# EAGLE design m140_attiny_V5c (EAGLE 6.5.0)
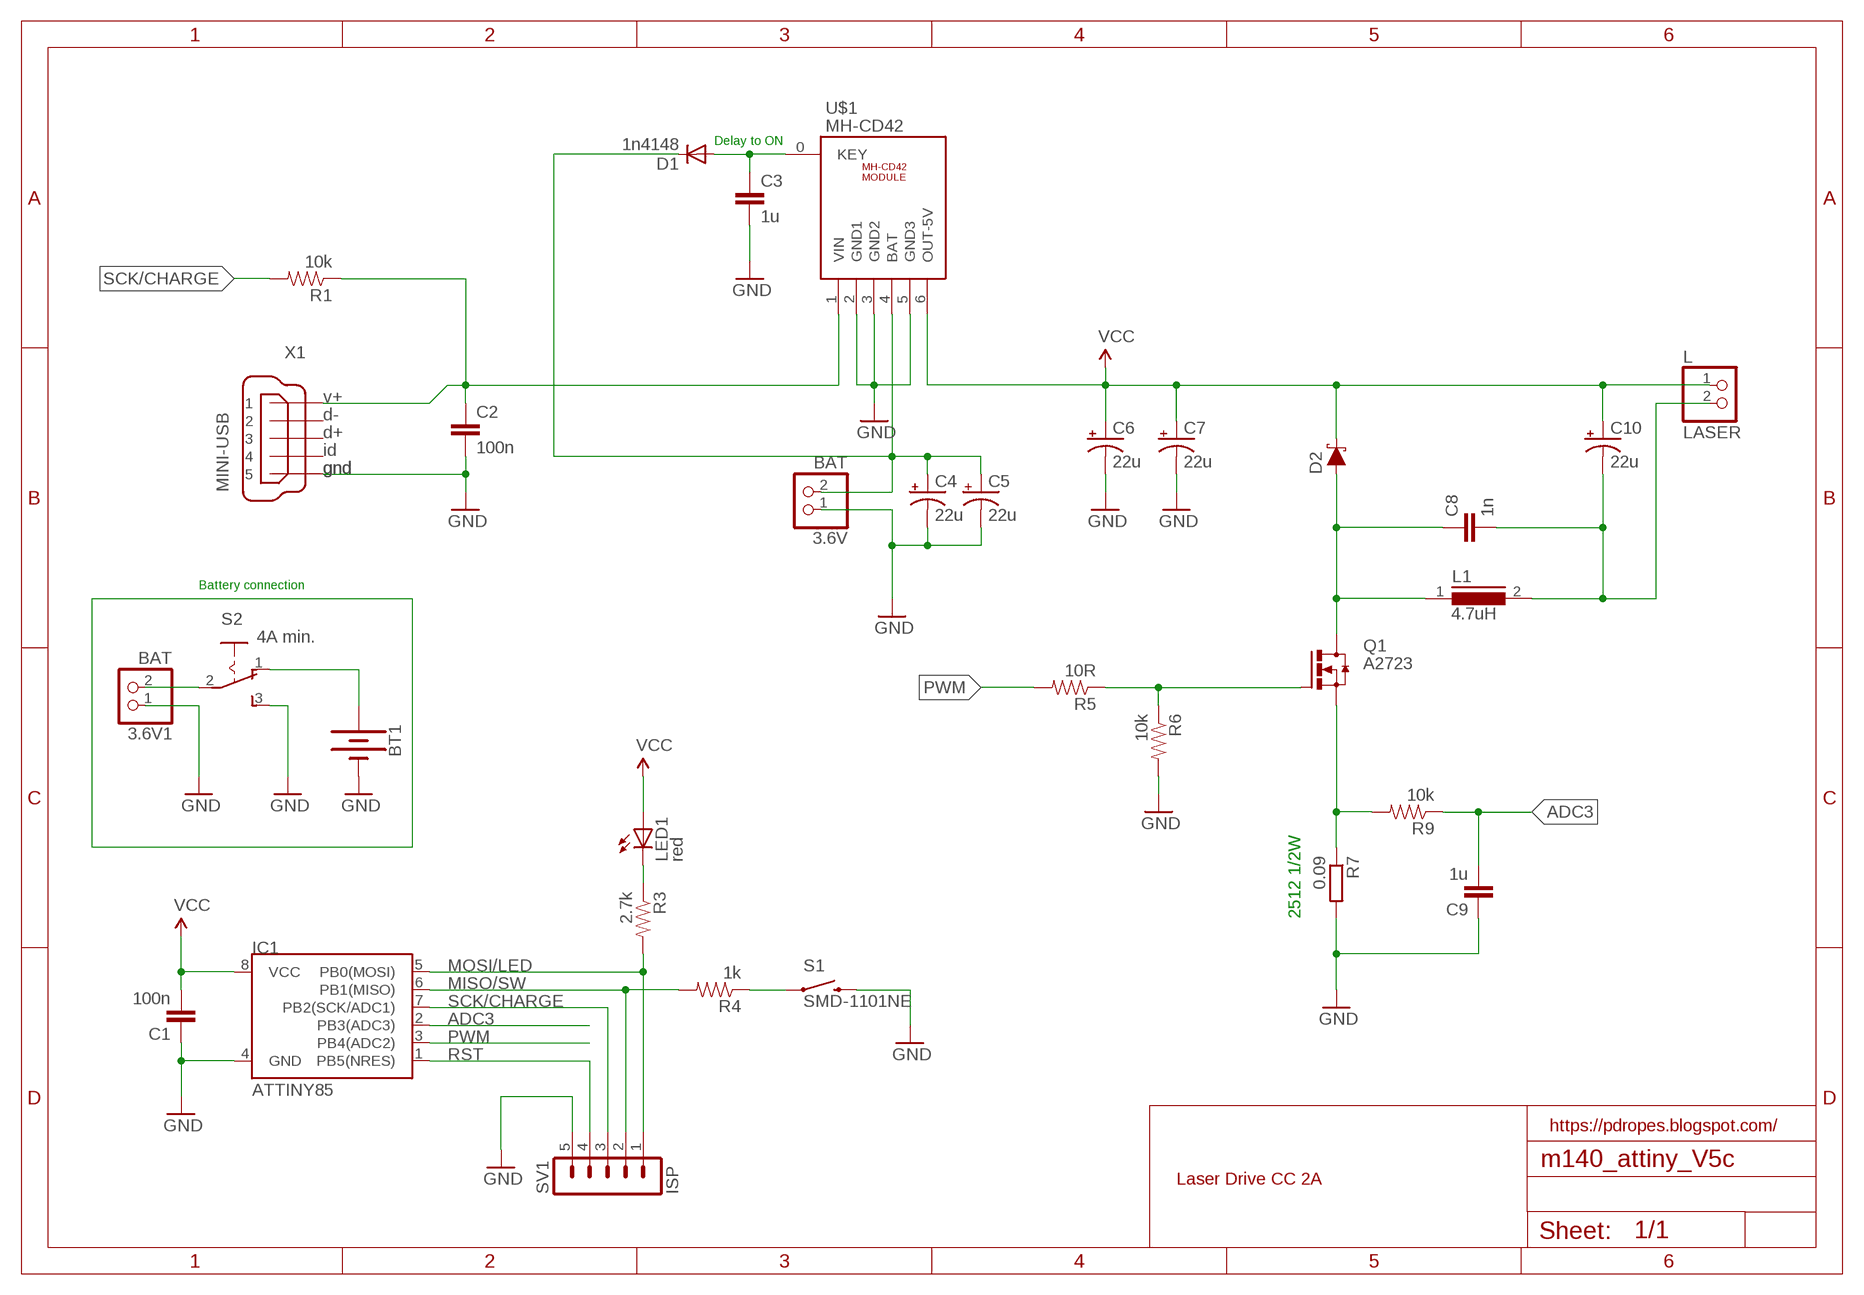
[diagram p0: schematic, sheet 1]

## Parts
3.6V  BAT  PINHD-1X2  [1X02]
3.6V1  BAT  PINHD-1X2  [1X02]
BT1  BATTERY-18650  [BATTERY_18650-HOLDER]
C1  100n  CAP0805  [0805]
C2  100n  CAP0805  [0805]
C3  1u  CAP0805  [0805]
C4  22u  CAP_POL1206-KIT  [EIA3216-KIT]
C5  22u  CAP_POL1206-KIT  [EIA3216-KIT]
C6  22u  CAP_POL1206-KIT  [EIA3216-KIT]
C7  22u  CAP_POL1206-KIT  [EIA3216-KIT]
C8  1n  CAP0805  [0805]
C9  1u  CAP0805  [0805]
C10  22u  CAP_POL1206-KIT  [EIA3216-KIT]
D1  1n4148  DIODE-MICROMELF-R  [MICROMELF-R]
D2  3A/40V/500mV  DIODE-SCHOTTKY-B340A  [SMA-DIODE]
IC1  ATTINY85  ATTINY45  [SO08-EIAJ]
L  LASER  PINHD-1X2  [1X02]
L1  4.7uH  DR74  [DR74]
LED1  red  LEDCHIPLED_0805  [CHIPLED_0805]
Q1  A2723  TPCA8005-H  [SOP-ADVANCE]
R1  10k  RESISTOR0805-RES  [0805]
R3  2.7k  RESISTOR0805-RES  [0805]
R4  1k  RESISTOR0805-RES  [0805]
R5  10R  RESISTOR0805-RES  [0805]
R6  10k  RESISTOR0805-RES  [0805]
R7  0.09  R-EU_R2512  [R2512]
R9  10k  RESISTOR0805-RES  [0805]
S1  SMD-1101NE  SWITCH-MOMENTARY-2-SMD-1101NE  [TACTILE-SWITCH-1101NE]
S2  4A min.  255SB  [255SB]
SV1  ISP  MA05-1  [MA05-1]
U$1  MH-CD42  [MH-CD42]
X1  MINI-USB  MINI-USB-32005-301  [32005-301]

## Nets
ADC3: C9.2 IC1.2(PB3(ADC3)) R9.1
B+: 3.6V.2 C4.A(+) C5.A(+) D1.C U$1.4(BAT)
GND: 3.6V1.1 3.6V.1 BT1.GND@1(-) C1.1 C2.2 C3.2 C4.C(-) C5.C(-) C6.C(-) C7.C(-) C9.1 IC1.4(GND) R6.2 R7.2 S1.P$2 S2.3(S) SV1.5 U$1.2(GND1) U$1.3(GND2) U$1.5(GND3) X1.5
KEY: C3.1 D1.A U$1.0(KEY)
L-: C8.2 C10.C(-) L1.2 L.2
MISO/SW: IC1.6(PB1(MISO)) R4.2 SV1.2
MOSI/LED: IC1.5(PB0(MOSI)) R3.2 SV1.1
N$1: BT1.PWR@1(+) S2.1(O)
N$4: R4.1 S1.P$1
N$5: 3.6V1.2 S2.2(P)
N$6: LED1.C R3.1
PWM: IC1.3(PB4(ADC2)) R5.2
Q1D: C8.1 D2.A L1.1 Q1.5(D) Q1.6(D) Q1.7(D) Q1.8(D) Q1.TH(D)
Q1G: Q1.4(G) R5.1 R6.1
Q1S: Q1.1(S) Q1.2(S) Q1.3(S) R7.1 R9.2
RST: IC1.1(PB5(NRES)) SV1.4
SCK/CHARGE: IC1.7(PB2(SCK/ADC1)) R1.2 SV1.3
USB+: C2.1 R1.1 U$1.1(VIN) X1.1
VCC: C1.2 C6.A(+) C7.A(+) C10.A(+) D2.C IC1.8(VCC) L.1 LED1.A U$1.6(OUT-5V)
Unconnected: X1.2 X1.3 X1.4

## Notes on the sheet
- Delay to ON
- v+
- d-
- d+
- id
- gnd | gnd
- Battery connection
- 2512 1/2W
- https://pdropes.blogspot.com/
- Laser Drive CC 2A

## Library data of the parts
3.6V 3.6V1 L = pinhead:PINHD-1X2: PIN HEADER
BT1 = SparkFun-Batteries:BATTERY: Battery - Single Cell A variety of battery chemistries, sizes, and footprints. Device List: 20MM_PTH - Coin Cell Battery Holder - 20mm (PTH) <https://www.sparkfun.com/products/783> 20MM_PTH_KIT- Coin Cell battery Holder - 20 mm (PTH) <http://www.sparkfun.com/products/783>kit version with special mask 6.8MM_PTH - Coin Cell Battery Holder - 6.8MM(SMD) <https://www.digikey.com/product-detail/en/seiko-instruments/MS621FE-FL11E/728-1057-ND/1889208?WT.srch=1&gclid=CNOQ5a6LzdQCFZS2wAodXCkE0g> 12MM_SMD - Coin Cell Battery Holder - 12mm (SMD) <https://www.sparkfun.com/products/10592> 12MM_PTH - Coin Cell Battery Holder - 12mm (PTH) <https://www.sparkfun.com/products/7948> 20MM_SMD - 20mm Coin Cell Battery Holder (SMD) (2 legs) Used on the Big Time Watch Kit <https://www.sparkfun.com/products/11734> 20MM_SMD_4LEGS - Coin Cell Battery Holder - 20mm (SMD) <https://www.sparkfun.com/products/11892> 20MM_SMD_4LEGS_OVERPASTE - Coin Cell Battery Holder - 20mm (SMD) <https://www.sparkfun.com/products/11892> (Over-paste on the legs) 24.5MM_PTH - Coin Cell Battery Holder - 24.5mm (PTH) <https://www.sparkfun.com/products/8863> 9V - 9V Battery Holder - PC Mount Used on the SparkFun SparkPunk Sound Kit <https://www.sparkfun.com/products/11177> and SparkFun SparkPunk Sequencer Kit <https://www.sparkfun.com/products/12707> 18650 - Battery Holder - 18650 (PTH) <https://www.sparkfun.com/products/13113> AA - Battery Holder - 1xAA (PTH) <https://www.sparkfun.com/products/7949> AAA - Battery Holder - 1xAAA (PTH) <https://www.sparkfun.com/products/12718> AA_KIT - Battery Holder - 1xAA (PTH) <https://www.sparkfun.com/products/7949> Special kit package - pads only have exposed copper on one side of the board. AAA_KIT - Battery Holder - 1xAAA (PTH) <https://www.sparkfun.com/products/12718> Special kit package - pads only have exposed copper on one side of the board.; PROD_ID: BATT-12327; SF_SKU: PRT-13113
C1-C3 C8 C9 = SparkFun:CAP: Capacitor Standard 0603 ceramic capacitor, and 0.1" leaded capacitor.
C4-C7 C10 = SparkFun:CAP_POL: Capacitor Polarized These are standard SMD and PTH capacitors. Normally 10uF, 47uF, and 100uF in electrolytic and tantalum varieties. Always verify the external diameter of the through hole cap, it varies with capacity, voltage, and manufacturer. The EIA devices should be standard.
D1 = diode:DIODE-: DIODE
D2 = SparkFun-DiscreteSemi:DIODE-SCHOTTKY: Schottky diode A Schottky diode is a semiconductor diode which has a low forward voltage drop and a very fast switching action.; PROD_ID: DIO-09886
IC1 = SparkFun:ATTINY45: Atmel ATTiny45
L1 = inductors:DR74: High Power Density, High Efficiency, Shielded Inductors Source: coiltronics_dr_series.pdf
LED1 = led:LED: LED OSRAM: - CHIPLED LG R971, LG N971, LY N971, LG Q971, LY Q971, LO R971, LY R971 LH N974, LH R974 LS Q976, LO Q976, LY Q976 LO Q996 - Hyper CHIPLED LW Q18S LB Q993, LB Q99A, LB R99A - SideLED LS A670, LO A670, LY A670, LG A670, LP A670 LB A673, LV A673, LT A673, LW A673 LH A674 LY A675 LS A676, LA A676, LO A676, LY A676, LW A676 LS A679, LY A679, LG A679 - Hyper Micro SIDELED® LS Y876, LA Y876, LO Y876, LY Y876 LT Y87S - SmartLED LW L88C, LW L88S LB L89C, LB L89S, LG L890 LS L89K, LO L89K, LY L89K LS L896, LA L896, LO L896, LY L896 - TOPLED LS T670, LO T670, LY T670, LG T670, LP T670 LSG T670, LSP T670, LSY T670, LOP T670, LYG T670 LG T671, LOG T671, LSG T671 LB T673, LV T673, LT T673, LW T673 LH T674 LS T676, LA T676, LO T676, LY T676, LB T676, LH T676, LSB T676, LW T676 LB T67C, LV T67C, LT T67C, LS T67K, LO T67K, LY T67K, LW E67C LS E67B, LA E67B, LO E67B, LY E67B, LB E67C, LV E67C, LT E67C LW T67C LS T679, LY T679, LG T679 LS T770, LO T770, LY T770, LG T770, LP T770 LB T773, LV T773, LT T773, LW T773 LH T774 LS E675, LA E675, LY E675, LS T675 LS T776, LA T776, LO T776, LY T776, LB T776 LHGB T686 LT T68C, LB T68C - Hyper Mini TOPLED® LB M676 - Mini TOPLED Santana® LG M470 LS M47K, LO M47K, LY M47K Source: http://www.osram.convergy.de LUXEON: - LUMILED® LXK2-PW12-R00, LXK2-PW12-S00, LXK2-PW14-U00, LXK2-PW14-V00 LXK2-PM12-R00, LXK2-PM12-S00, LXK2-PM14-U00 LXK2-PE12-Q00, LXK2-PE12-R00, LXK2-PE12-S00, LXK2-PE14-T00, LXK2-PE14-U00 LXK2-PB12-K00, LXK2-PB12-L00, LXK2-PB12-M00, LXK2-PB14-N00, LXK2-PB14-P00, LXK2-PB14-Q00 LXK2-PR12-L00, LXK2-PR12-M00, LXK2-PR14-Q00, LXK2-PR14-R00 LXK2-PD12-Q00, LXK2-PD12-R00, LXK2-PD12-S00 LXK2-PH12-R00, LXK2-PH12-S00 LXK2-PL12-P00, LXK2-PL12-Q00, LXK2-PL12-R00 Source: www.luxeon.com KINGBRIGHT: KA-3528ASYC Source: www.kingbright.com
Q1 = transistor-power:TPCA8005-H
R1 R3-R6 R9 = SparkFun:RESISTOR: Resistor Basic schematic elements and footprints for 0603, 1206, and PTH resistors.
R7 = resistor:R-EU_: RESISTOR, European symbol
S1 = SparkFun:SWITCH-MOMENTARY-2
S2 = switch:255SB: SLIDING SWITCH Distributor Buerklin, 11G810
SV1 = con-lstb:MA05-1: PIN HEADER; OC_FARNELL: unknown; OC_NEWARK: unknown
U$1 = MH-CD42:MH-CD42
X1 = m140_attiny_V5:MINI-USB-: MINI USB-B Conector Source: www.cypressindustries.com; OC_FARNELL: unknown; OC_NEWARK: unknown

## Board
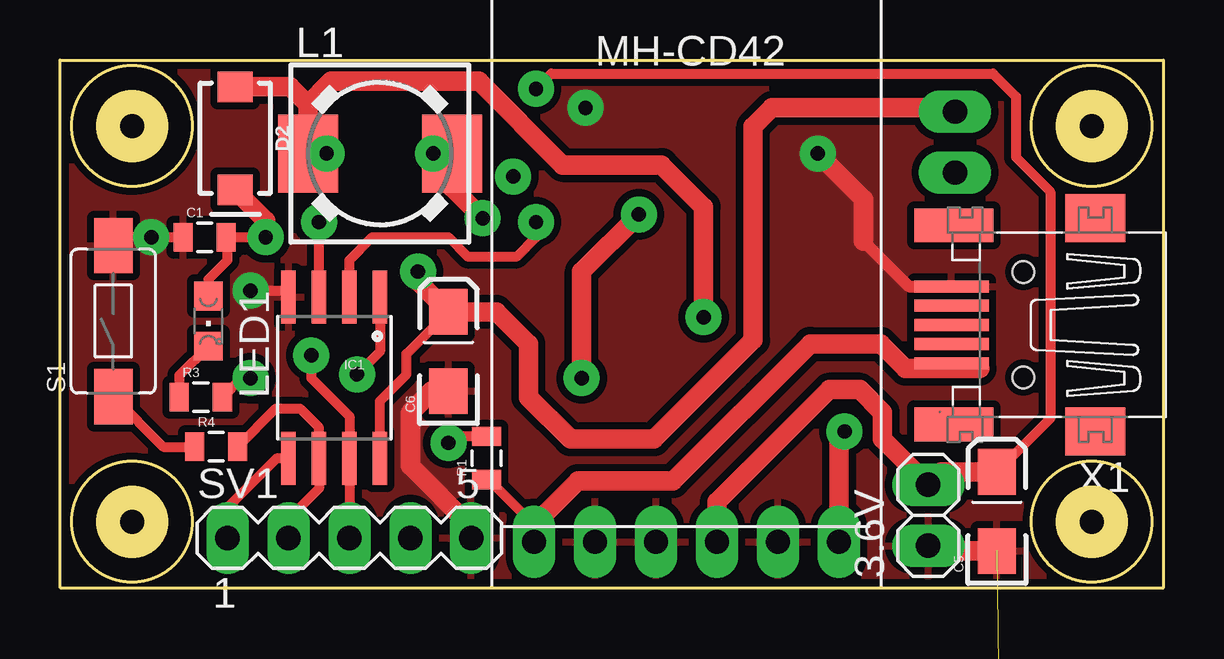
[diagram p1: board, top side]
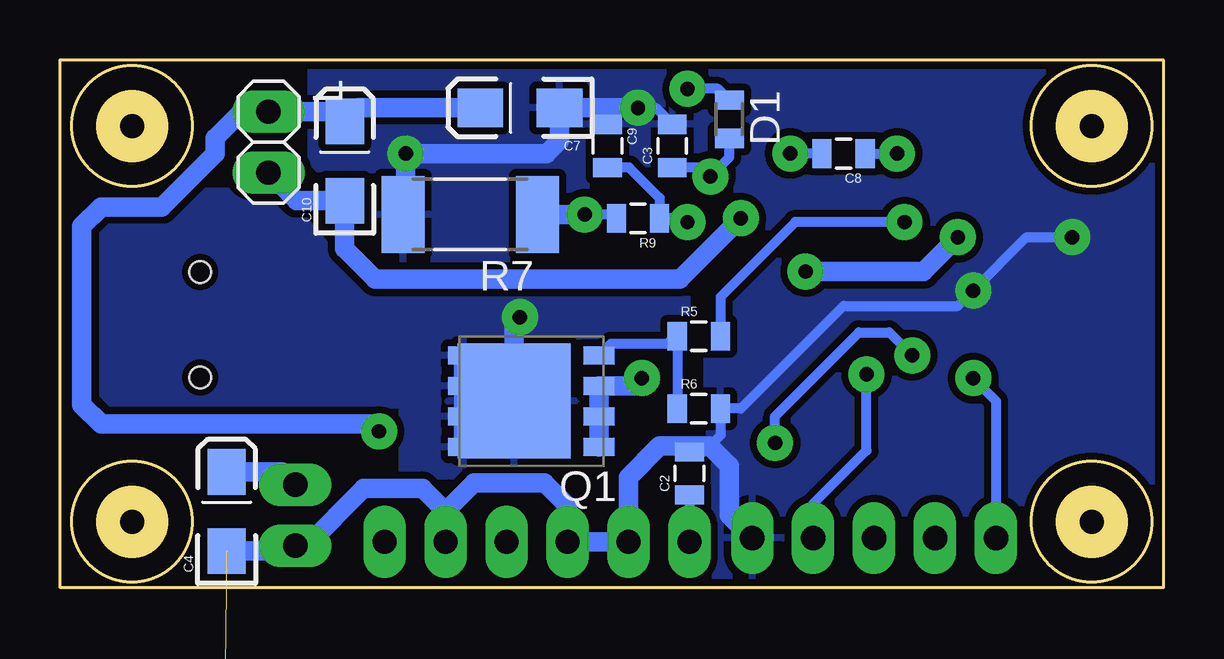
[diagram p2: board, bottom side, seen from below]

Size 46 x 22 mm. Coordinates in mm from the lower left corner, seen from the top.
Copper layers (1*16): Top 0.035mm / dielectric 1.5mm / Bottom 0.035mm
Design rules "DROPES_m140": minimum track width 16mil, minimum drill 0.6mm, track to track 0.3mm, track to pad 0.3mm, pad to pad 0.3mm, via to via 0.3mm, smd to smd 0mil, copper to edge 0.3mm, drill to drill 0.1mm, minimum pad ring 15mil, minimum via ring 8mil, stop-mask expansion 4mil, vias tented up to drill 0mil, thermal gap 0.3mm

### Footprints (pad centres in the part's own frame; a part is rotated, then mirrored left to right if it is on the bottom)
1X02 = drill 1.016 long: 1 -1.27,0; 2 1.27,0
BATTERY_18650-HOLDER = drill 1.829: GND@1 30.628,0.01; GND@2 23.88,2.55; GND@3 23.88,-2.53; PWR@1 -30.628,-0.01; PWR@2 -23.88,2.53; PWR@3 -23.88,-2.55
0805 = smd 0.8 x 1.2: 1 -0.9,0; 2 0.9,0
EIA3216-KIT = smd 1.9 x 1.6: A 1.65,0; C -1.65,0
MICROMELF-R = smd 0.8 x 1.2: A 0.8,0; C -0.8,0
SMA-DIODE = smd 1.27 x 1.47: A -2.15,0; C 2.15,0
SO08-EIAJ = smd 0.61 x 2.21: 1 -1.905,-3.378; 2 -0.635,-3.378; 3 0.635,-3.378; 4 1.905,-3.378; 5 1.905,3.353; 6 0.635,3.353; 7 -0.635,3.353; 8 -1.905,3.353
DR74 = smd 2.5 x 3.25: 1 -3,0; 2 3,0
CHIPLED_0805 = smd 1.2 x 1.2: A 0,-1.05; C 0,1.05
SOP-ADVANCE = smd 1.3 x 0.75: 1 -2.825,1.905; 2 -2.825,0.635; 3 -2.825,-0.635; 4 -2.825,-1.905; 5 2.825,-1.905; 6 2.825,-0.635; 7 2.825,0.635; 8 2.825,1.905 | smd 4.7 x 4.8: TH 0.725,0
R2512 = smd 1.8 x 3.2: 1 -2.8,0; 2 2.8,0
TACTILE-SWITCH-1101NE = smd 2.3 x 1.6: P$1 -3.15,0; P$2 3.15,0
255SB = drill 1.118 long: 1 -3.81,0; 2 0,0; 3 3.81,0
MA05-1 = drill 1.016 long: 1 -5.08,0; 2 -2.54,0; 3 0,0; 4 2.54,0; 5 5.08,0
MH-CD42 = drill 0.6 pad 1.5: 0 -0.873,15.24 | drill 1 long: 1 0,0; 2 2.54,0; 3 5.08,0; 4 7.62,0; 5 10.16,0; 6 12.7,0
32005-301 = smd 3.1 x 0.5: 1 3,1.6; 2 3,0.8; 3 3,0; 4 3,-0.8; 5 3,-1.6 | smd 2.5 x 2: M1 -3,-4.45; M2 -3,4.45 | smd 3.3 x 1.4: M3 2.9,4.15; M4 2.9,-4.15 | hole 0.9: 0,2.2; 0,-2.2

### Placement (x,y rotation side)
3.6V  36.2,3.02 90 top
3.6V1  38.1,-22.86 180 top  (outside the outline)
BT1  35.56,-29.21 0 top  (outside the outline)
C1  6.03,14.61 0 top
C2  19.76,4.76 90 bottom
C3  20.48,18.41 90 bottom
C4  39.05,3.17 90 bottom
C5  39.05,3.17 90 top
C6  16.19,9.84 90 top
C7  26.83,20 180 bottom
C8  13.34,18.1 180 bottom
C9  23.18,18.41 270 bottom
C10  34.13,17.78 90 bottom
D1  18.1,19.53 270 bottom
D2  7.3,18.73 270 top
IC1  11.43,8.73 180 top
L  37.31,18.57 270 bottom
L1  13.34,18.1 0 top
LED1  6.19,11.11 180 top
Q1  26.35,7.78 180 bottom
R1  17.78,5.4 90 top
R3  5.87,7.94 0 top
R4  6.51,5.87 0 top
R5  19.37,10.48 0 bottom
R6  19.37,7.46 0 bottom
R7  28.89,15.56 180 bottom
R9  21.91,15.4 180 bottom
S1  2.22,11.11 90 top
S2  35.56,-29.21 0 top  (outside the outline)
SV1  12.06,2.06 0 top
U$1  19.76,1.91 0 top
U$2  [LASER_HEAT_SINK]  0,0 0 top
X1  40.16,10.95 180 top

### Tracks (layer width: path | path; a pad name or v marks a point on that pad's centre or on a via)
ADC3  (via drill 0.6 pad 1.5)
  Top 0.406: IC1.2 12.06,13.65 13.02,14.61 16.19,14.61 16.99,13.81 19.05,13.81 19.84,14.61 v19.84,15.24
  Bottom 0.406: v19.84,15.24 20,15.4 R9.1 21.01,16.25 22.28,17.52 C9.2
B+  (via drill 0.6 pad 1.5)
  Top 0.406: v19.84,20.8 20.48,21.43 38.89,21.43 39.85,20.48 39.85,17.94 41.27,16.51 41.27,7.05 C5.A
  Top 0.813: U$1.4 27.38,3.57 32.07,8.26 33.34,8.26 34.29,7.3 34.29,6.19 3.6V.2 36.73,4.83 C5.A
  Bottom 0.406: D1.C 18.57,20.8 v19.84,20.8
  Bottom 0.813: C5.A 36.73,4.83 3.6V.2
GND  (via drill 0.6 pad 1.5)  (3 unrouted)
  Top 0.406: S1.P$2 2.56,14.61 v3.81,14.61 C1.1 | v7.94,12.38 9.25,12.38 IC1.4
  Top 0.5: 33.5,14.45 35.39,12.55 X1.5
  Top 0.813: SV1.5 17.14,2.54 14.61,5.08 14.61,7.3 15.49,8.19 C6.C | v31.59,18.1 33.5,16.19 33.5,14.45 | 3.6V.1 36.42,1.52 C5.C
  Bottom 0.406: v3.81,14.61 5.71,14.61 v7.94,12.38 8.57,11.75 13.34,11.75 17.62,7.46 R6.2 18.47,6.35 19.16,5.66 C2.2 | C9.1 22.49,20 v21.91,20 21.17,20 C3.2
  Bottom 0.813: 29.92,3.17 U$1.5 | SV1.5 18.1,3.02 18.1,5.08 18.92,5.9 21.01,5.9 22.3,4.6 U$1.2 U$1.3 24.84,3.41 25.8,4.37 28.73,4.37 29.92,3.17 | R7.2 31.59,15.66 v31.59,18.1 25.72,18.1 25.18,18.64 C7.C v21.91,20 | 29.92,3.17 30.88,4.13 33.34,4.13 35.72,1.75 3.6V.1 36.42,1.52 C5.C
  pour Top: 0,0 46.04,0 46.04,21.91 0,21.91
  pour Bottom: 0,0 0,21.91 35.56,21.91 35.56,17.78 31.75,13.65 19.05,13.65 19.05,0
KEY
  Bottom 0.406: D1.A 18.1,17.94 U$1.0 19.26,17.52 C3.1
L-  (via drill 0.6 pad 1.5)
  Top 0.406: 16.18,17.94 L1.2 v15.56,18.1
  Top 0.813: v17.62,15.4 16.34,16.68 L1.2
  Bottom 0.406: C8.2 v15.56,18.1
  Bottom 0.813: v17.62,15.4 20.16,12.86 32.86,12.86 34.13,14.13 C10.C 36.13,16.13 L.2
MISO/SW
  Top 0.406: SV1.2 9.53,2.86 10.79,4.13 IC1.6 10.79,6.67 10,7.46 9,7.46 R4.2
MOSI/LED  (via drill 0.6 pad 1.5)
  Top 0.406: R3.2 7.57,8.73 v7.94,8.73 | IC1.5 9.03,5.38 6.99,3.33 SV1.1
  Bottom 0.406: v7.94,8.73 6.99,7.78 SV1.1
N$1  (1 unrouted)
N$4
  Top 0.406: S1.P$1 4.31,5.87 R4.1
N$5  (1 unrouted)
N$6
  Top 0.406: LED1.C 4.97,8.85 R3.1
PWM  (via drill 0.6 pad 1.5)
  Top 0.406: IC1.3 v10.79,15.24
  Bottom 0.406: v10.79,15.24 15.35,15.24 18.47,12.12 R5.2
Q1D  (via drill 0.6 pad 1.5)
  Top 0.406: v11.11,18.1 L1.1
  Top 0.813: D2.A 9.6,20.88 10.34,20.14 | v26.83,11.27 26.83,15.88 25.08,17.62 20.95,17.62 17.46,21.11 11.3,21.11 10.34,20.14 | 10.34,20.14 L1.1
  Bottom 0.406: C8.1 v11.11,18.1
  Bottom 0.813: Q1.8 Q1.7 | Q1.5 Q1.6 Q1.7 | Q1.TH 27.08,7.62 | v26.83,11.27 27.08,11.02 Q1.TH | Q1.7 28.54,7.78 Q1.TH
  pour Bottom: 19.84,4.76 19.84,12.06 33.02,12.06 36.83,16.51 40.01,16.51 41.27,15.24 43.81,15.24 44.45,14.61 44.45,8.26 43.81,7.62 31.75,7.62 31.75,4.6 26.67,4.76
Q1G
  Bottom 0.406: Q1.4 23.05,10.16 20.69,10.16 20.27,10.58 R5.1 R6.1
Q1S  (via drill 0.6 pad 1.5)
  Top 0.813: v21.75,8.73 21.75,13.18 v24.13,15.56
  Bottom 0.406: R9.2 22.97,15.56 v24.13,15.56
  Bottom 0.813: Q1.1 Q1.2 Q1.3 22.07,8.41 v21.75,8.73 | R7.1 v24.13,15.56
RST  (via drill 0.6 pad 1.5)
  Top 0.406: IC1.1 13.34,9.84 v12.38,8.89
  Bottom 0.406: SV1.4 14.61,3.49 12.38,5.71 v12.38,8.89
SCK/CHARGE  (via drill 0.6 pad 1.5)
  Top 0.406: SV1.3 IC1.7 12.06,7.14 10.48,8.73 v10.48,9.68 | R1.2 16.46,6.3 v16.19,6.03
  Bottom 0.406: v16.19,6.03 16.19,7.14 12.7,10.64 11.43,10.64 v10.48,9.68
USB+
  Top 0.406: R1.1 17.89,4.5 19.76,2.62
  Top 0.5: X1.1 37.39,9.13 38.1,9.13
  Top 0.813: U$1.1 19.76,2.62 21.59,4.45 25.56,4.45 31.27,10.16 34.21,10.16 35.24,9.13 38.1,9.13 38.34,9.13
  Bottom 0.406: C2.1 U$1.1
VCC  (via drill 0.6 pad 1.5)
  Top 0.406: v8.57,14.61 C1.2 6.99,14.55 6.99,13.65 6.19,12.86 LED1.A | C6.A 14.45,9.75 14.45,8.89 13.34,7.78 IC1.8
  Top 0.813: D2.C 8.57,15.31 v8.57,14.61 | v14.92,13.18 14.92,12.76 C6.A | C6.A 16.45,11.49 | L.1 37.15,20 29.69,20 28.89,19.21 28.89,10.32 24.77,6.19 21.27,6.19 19.53,7.94 19.53,10.16 18.19,11.49 C6.A | v32.7,6.51 32.46,6.27 U$1.6
  Bottom 0.813: C10.A 33.75,19.43 | v14.92,13.18 10,13.18 v8.57,14.61 | v32.7,6.51 33.02,6.83 44.29,6.83 45.09,7.62 45.09,15.08 44.29,15.88 41.75,15.88 39.53,18.1 39.53,18.73 38.42,19.84 L.1 34.55,19.84 C10.A | C7.A 33.56,20 C10.A

### Text on the board
Document: L.GND | Dropes / M140 | B.GND